# Altium schematic sheet A4_TDR_Schematic_PB.SchDoc: Bardzo zaawansowany, madrze brzmiacy temat pracy dyplomowej. Jest tez bardzo dlugi.
size A4 portrait; Author: Student X.; Revision: 1.0; SheetNumber: 1; SheetTotal: 1; Comments: param:Comments; Wersja: 1.0; CustomerInfo: CustInfo; CustomerAddress: CustAddr; CopyrightBy: Maciejo; CopyrightDate: 2016; TopSheet: Nazwa lub sciezka do pliku z glownym schematem projektu; CurrentSheet: Current sheet; NrIndeksu: 123456; Promotor: Prof. dr. hab. inż. arch. lek. artysta i tynkarz; ProjectName: Project Name
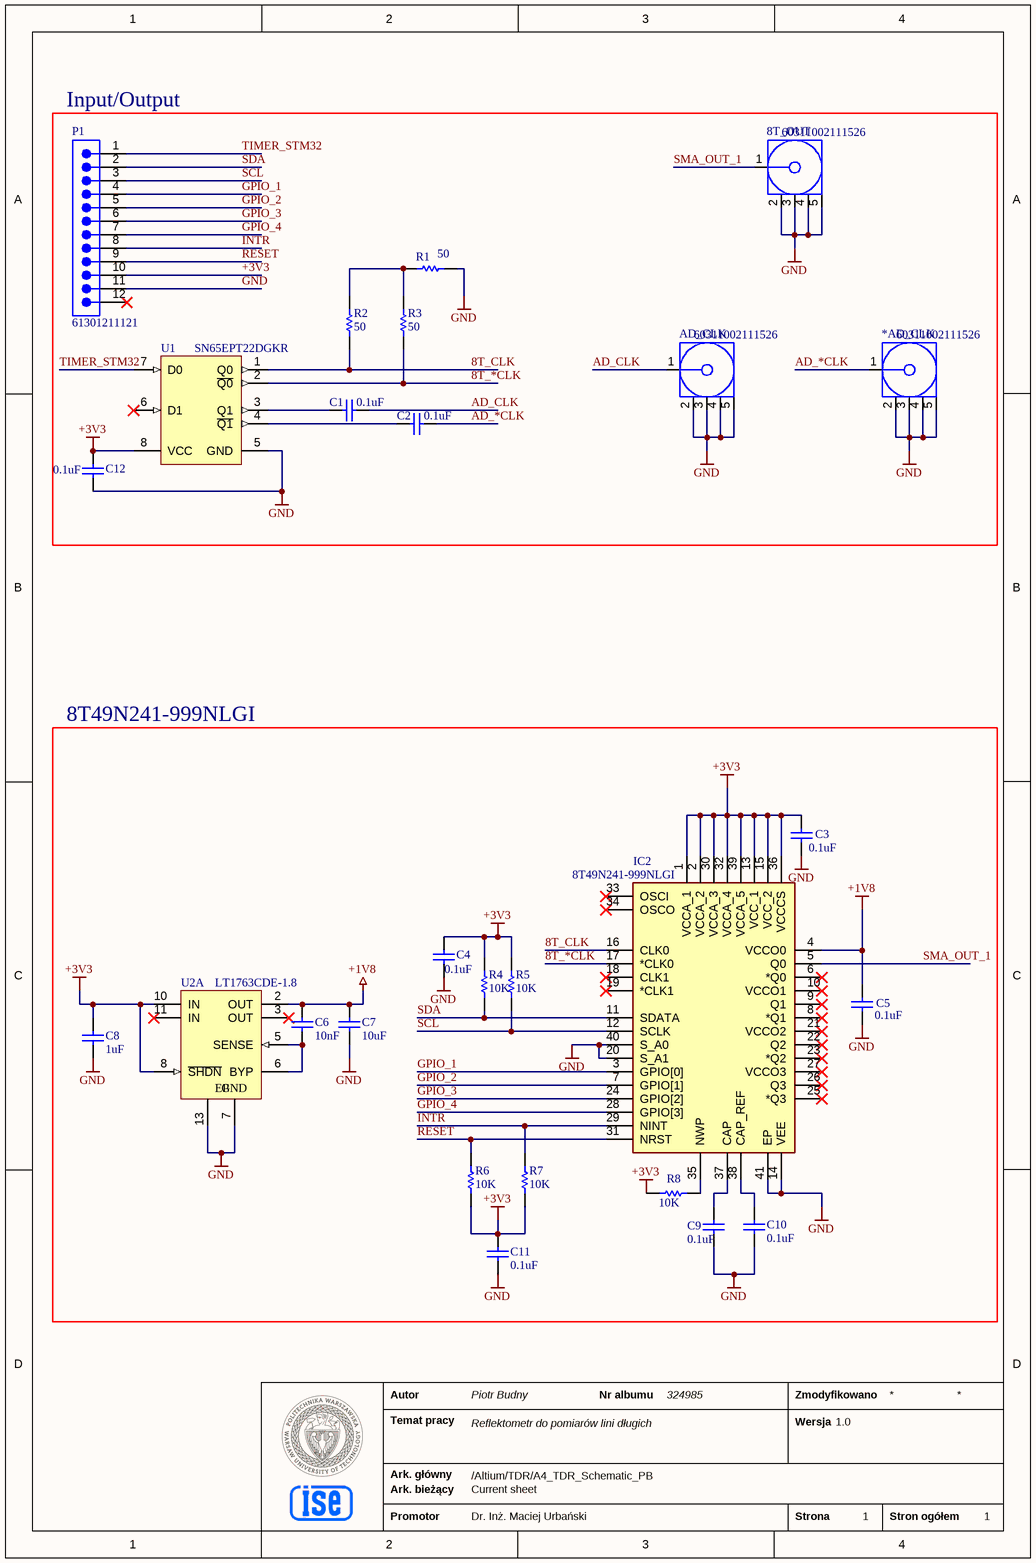
[diagram p0: A4_TDR_Schematic_PB.SchDoc]

## Parts
8T_OUT  60311002111526  [60311002111526]
*AD_CLK  60311002111526  [60311002111526]
AD_CLK  60311002111526  [60311002111526]
C1  0.1uF  [WCAP-CSGP_0402_L1W0.5H0.5]
C2  0.1uF  [WCAP-CSGP_0402_L1W0.5H0.5]
C3  0.1uF  [WCAP-CSGP_0402_L1W0.5H0.5]
C4  0.1uF  [WCAP-CSGP_0402_L1W0.5H0.5]
C5  0.1uF  [WCAP-CSGP_0402_L1W0.5H0.5]
C6  10nF  [WCAP-CSGP_0402_L1W0.5H0.5]
C7  10uF  [WCAP-CSGP_0805_L2W1.25H1.25]
C8  1uF  [WCAP-CSGP_0603_L1.6W0.8H0.8_Reflow]
C9  0.1uF  [WCAP-CSGP_0402_L1W0.5H0.5]
C10  0.1uF  [WCAP-CSGP_0402_L1W0.5H0.5]
C11  0.1uF  [WCAP-CSGP_0402_L1W0.5H0.5]
C12  0.1uF  [WCAP-CSGP_0402_L1W0.5H0.5]
IC2  8T49N241-999NLGI  [QFN50P600X600X100-41N]
P1  61301211121  [61301211121]
R1  50  [RESC1005X40X25ML10T10]
R2  50  [RESC1005X40X25ML10T10]
R3  50  [RESC1005X40X25ML10T10]
R4  10K  [RESC3216X70X50LL20T25]
R5  10K  [RESC3216X70X50LL20T25]
R6  10K  [RESC3216X70X50LL20T25]
R7  10K  [RESC3216X70X50LL20T25]
R8  10K  [RESC3216X70X50LL20T25]
U1  SN65EPT22DGKR  [DGK0008A_M]
U2  LT1763CDE-1.8  [LT-DE-UE-12_V]  (part A of 2)

## Blocks framed on the sheet
Input/Output: 8T_OUT *AD_CLK AD_CLK C1 C2 C12 P1 R1-R3 U1
8T49N241-999NLGI: C3-C11 IC2 R4-R8 U2

## Nets
+1V8: C5.2 C6.2 C7.2 IC2.4(VCCO0) U2.2(OUT)
+3V3: C3.2 C4.2 C8.2 C11.2 C12.2 IC2.1(VCCA_1) IC2.2(VCCA_2) IC2.13(VCC_1) IC2.15(VCC_2) IC2.30(VCCA_3) IC2.32(VCCA_4) IC2.36(VCCCS) IC2.39(VCCA_5) P1.10 R4.2 R5.2 R6.1 R7.1 R8.2 U1.8(VCC) U2.8(~{SHDN}) U2.10(IN)
GND: 8T_OUT.2(GND) 8T_OUT.3(GND) 8T_OUT.4(GND) 8T_OUT.5(GND) *AD_CLK.2(GND) *AD_CLK.3(GND) *AD_CLK.4(GND) *AD_CLK.5(GND) AD_CLK.2(GND) AD_CLK.3(GND) AD_CLK.4(GND) AD_CLK.5(GND) C3.1 C4.1 C5.1 C7.1 C8.1 C9.1 C10.1 C11.1 C12.1 IC2.14(VEE) IC2.20(S_A1) IC2.40(S_A0) IC2.41(EP) P1.11 R1.2 U1.5(GND) U2.7(GND) U2.13(EP)
8T_*CLK: IC2.17(*CLK0) R3.1 U1.2(~{Q0})
8T_CLK: IC2.16(CLK0) R2.1 U1.1(Q0)
AD_*CLK: *AD_CLK.1(Signal) C2.2
AD_CLK: AD_CLK.1(Signal) C1.2
GPIO_1: IC2.3(GPIO[0]) P1.4
GPIO_2: IC2.7(GPIO[1]) P1.5
GPIO_3: IC2.24(GPIO[2]) P1.6
GPIO_4: IC2.28(GPIO[3]) P1.7
INTR: IC2.29(NINT) P1.8 R7.2
RESET: IC2.31(NRST) P1.9 R6.2
SCL: IC2.12(SCLK) P1.3 R5.1
SDA: IC2.11(SDATA) P1.2 R4.1
SMA_OUT_1: 8T_OUT.1(Signal) IC2.5(Q0)
TIMER_STM32: P1.1 U1.7(D0)
NetC1_1: C1.1 U1.3(Q1)
NetC2_1: C2.1 U1.4(~{Q1})
NetC6_1: C6.1 U2.5(SENSE) U2.6(BYP)
NetC9_2: C9.2 IC2.37(CAP)
NetC10_2: C10.2 IC2.38(CAP_REF)
NetIC2_35: IC2.35(NWP) R8.1
NetR1_1: R1.1 R2.2 R3.2

Not connected (* = marked no-connect by the designer): IC2 6(*Q0)* 8(*Q1)* 9(Q1)* 10(VCCO1)* 18(CLK1)* 19(*CLK1)* 21(VCCO2)* 22(Q2)* 23(*Q2)* 25(*Q3)* 26(Q3)* 27(VCCO3)* 33(OSCI)* 34(OSCO)*; P1 12*; U1 6(D1)*; U2 3(OUT)* 11(IN)*

## Notes on the sheet
- Autor
- Temat pracy
- Piotr Budny
- Reflektometr do pomiarów lini długich
- Nr albumu
- 324985
- Zmodyfikowano
- Wersja
- Ark. główny
- Ark. bieżący
- /Altium/TDR/A4_TDR_Schematic_PB
- Promotor
- Dr. Inż. Maciej Urbański
- Strona
- Stron ogółem

## Library data of the parts
8T_OUT *AD_CLK AD_CLK = CMP-03913-134708249-2: 60311002111526 WR-SMA_SMA PCB THT Jack_Right Angle; Impedance: 50Ω; Insulation Resistance: 5GΩ; Connector Type: SMA; Insertion Loss (dB): 0.14dB; Max Operating Temperature: 165°C; NexarPartId: 134708249; Insulation Material: PTFE; Min Operating Temperature: -65°C
C1-C5 C9-C12 = CMP-207839-000049-2: CAP CER 0.1UF 10V X7R 0402; NexarPartId: 53703156; Tolerance: 10%; Material: Ceramic; Insulation Resistance: 5GΩ; Capacitance: 100nF; Mount: Surface Mount; Width: 500µm; Case Code (Metric): 1005; Thickness: 558.8µm; Max Operating Temperature: 125°C; Packaging: Tape & Reel (TR); Case Code (Imperial): 0402; Voltage Rating: 10V; Case/Package: 0402; Min Operating Temperature: -55°C; RoHS: Compliant; REACH SVHC: Unknown; Length: 1mm; Dielectric: X7R; Height: 500µm; Voltage Rating (DC): 10V
C6 = CMP-207839-000042-2: CAP CER 10000PF 10V X7R 0402; NexarPartId: 53703150; Material: Ceramic; Tolerance: 10%; Insulation Resistance: 10GΩ; Max Operating Temperature: 125°C; Case Code (Metric): 1005; RoHS: Compliant; Capacitance: 10nF; Mount: Surface Mount; Case Code (Imperial): 0402; Packaging: Tape & Reel (TR); Height: 500µm; Case/Package: 0402; Thickness: 558.8µm; Length: 1mm; Voltage Rating: 10V; Width: 500µm; Dielectric: X7R; Min Operating Temperature: -55°C; Voltage Rating (DC): 10V
C7 = CMP-03913-65419800-1: 885012207026 Multilayer Ceramic Capacitor, Wcap-Csgp Series, 10 F, 10%, X7r, 10 V, 0805 [2012 Metric]; Voltage Rating (DC): 10V; Insulation Resistance: 10MΩ; Capacitance: 10µF; Min Operating Temperature: -55°C; Case Code (Metric): 2012; Case Code (Imperial): 0805; Mount: Surface Mount; REACH SVHC: Unknown; Length: 2mm; RoHS: Compliant; Tolerance: 10%; Dielectric: X7R; Width: 1.25mm; Height: 1.25mm; Thickness: 1.4478mm; Max Operating Temperature: 125°C; Case/Package: 0805; Packaging: Digi-Reel®; NexarPartId: 65419800; Voltage Rating: 10V
C8 = CMP-207839-000022-2: CAP CER 1UF 10V X7R 0603; NexarPartId: 53914735; Insulation Resistance: 100MΩ; Material: Ceramic; Tolerance: 10%; Capacitance: 1µF; Packaging: Tape & Reel (TR); RoHS: Compliant; Length: 1.6mm; Voltage Rating (DC): 10V; Voltage Rating: 10V; Case Code (Imperial): 0603; Thickness: 939.8µm; Case Code (Metric): 1608; Max Operating Temperature: 125°C; Mount: Surface Mount; Dielectric: X7R; Case/Package: 0603; Height: 800µm; Width: 800µm; Min Operating Temperature: -55°C
IC2 = 8T49N241-999NLGI: Integrated Circuit; Manufacturer_Name: Renesas Electronics; Datasheet Link: https://www.idt.com/document/dst/8t49n241-datasheet; Height: 1mm; Manufacturer_Part_Number: 8T49N241-999NLGI; Mouser Part Number: 972-8T49N241-999NLGI; Mouser Price/Stock: https://www.mouser.co.uk/ProductDetail/Renesas-Electronics/8T49N241-999NLGI?qs=ZwKJWZfDtNjnVZ7GQAcPpQ%3D%3D
P1 = CMP-1502-01086-3: NexarPartId: 32855538; Contact Resistance: 20mΩ; Current Rating: 3A; Operating Supply Voltage: 250V; Number of Positions: 12; Connector Type: Male Pin; Gender: Male; Pitch: 2.54mm; Number of Pins: 12; Mount: Through Hole; Color: Black; RoHS: Compliant; Contact Plating: Gold; Contact Material: Copper; Packaging: Bulk; Orientation: Vertical; Number of Contacts: 12; Termination: Solder; Contact Mating Length: 5.9944mm; Lead Pitch: 2.54mm; REACH SVHC: Unknown; Number of Rows: 1
R1-R3 = CMP-2002-06296-1: Manufacturer: Multicomp; Part Number: MC00625W0402160R4
R4-R8 = CMP-2003-04407-1: Manufacturer: Panasonic; Part Number: ERA8AEB103V
U1 = CMP-0327-00215-3: 4000 Mbps 3.3 V Dual LVTTL / LVCMOS to Differential LVPECL Buffer, 2 Tx and 2 Rx, -40 to +85 degC, 8-pin VSSOP (DGK), Green (RoHS & no Sb/Br); Manufacturer: Texas Instruments; ICC(Max)(mA): 50; Input Signal: LVTTL, CMOS; No. of Rx: 2; SubFamily: PECL PHY; Signaling Rate(Mbps): 4000; xECL: TRUE; DatasheetVersion: SLLS926A; Output Signal: LVPECL; ComponentLink3Description: URL Link1; PackageVersion: revE, May-2006; ComponentLink1Description: Manufacturer URL; ComponentLink2Description: Datasheet; No. of Tx: 2; ComponentLink1URL: http://www.ti.com/; PackageReference: DGK0008A; Eco-Plan: Green (RoHS & no Sb/Br); Mounting Technology: Surface Mount; PackageDescription: 8-Pin Thin Small Outline Package 3 x 3 mm Body ,0.65 mm Pitch; ComponentLink2URL: http://www.ti.com/general/docs/lit/getliterature.tsp?genericPartNumber=SN65EPT22&fileType=pdf; ComponentLink3URL: SamplesURL:http://www.ti.com/product/sn65ept22#samples; PartNumber: SN65EPT22DGKR
U2 = CMP-0476-00416-1: 500 mA, Low Noise, LDO Micropower Regulator, 1.8 to 20 V Vin, 1.8 V Vout, 12-pin SON (DE-UE-12), -40 to 125 degC; Manufacturer: Linear Technology; Iout(mA): 500; Noise(uV): 20; Output Voltage: 1.8 V; Shutdown Current(uA): 1; Discrete Pass Element: no; PSRR(dB): 65; Dropout Voltage(V): 0.3; Isupply(mA): 0.03; Vin Min(V): 1.8; ComponentLink2Description: Datasheet; ComponentLink1URL: http://www.linear.com/; Mounting Technology: Surface Mount; ComponentLink3Description: Package Specification; ComponentLink1Description: Manufacturer URL; RoHS: FALSE; ComponentLink3URL: http://cds.linear.com/docs/en/packaging/DFN_12_05-08-1695.pdf; Vin Max(V): 20; PartNumber: LT1763CDE-1.8; PackageReference: DE-UE-12; DatasheetVersion: Rev. G; PackageVersion: Rev. D, 06/2010; Number of Outputs: 1; PackageDescription: 12-Pin Plastic DFN, Body 4 x 3 mm, Pitch 0.5 mm; ComponentLink2URL: http://cds.linear.com/docs/en/datasheet/1763fg.pdf; Code_JEDEC: MO-229